# EAGLE schematic connector_motor (EAGLE 7.1.0)
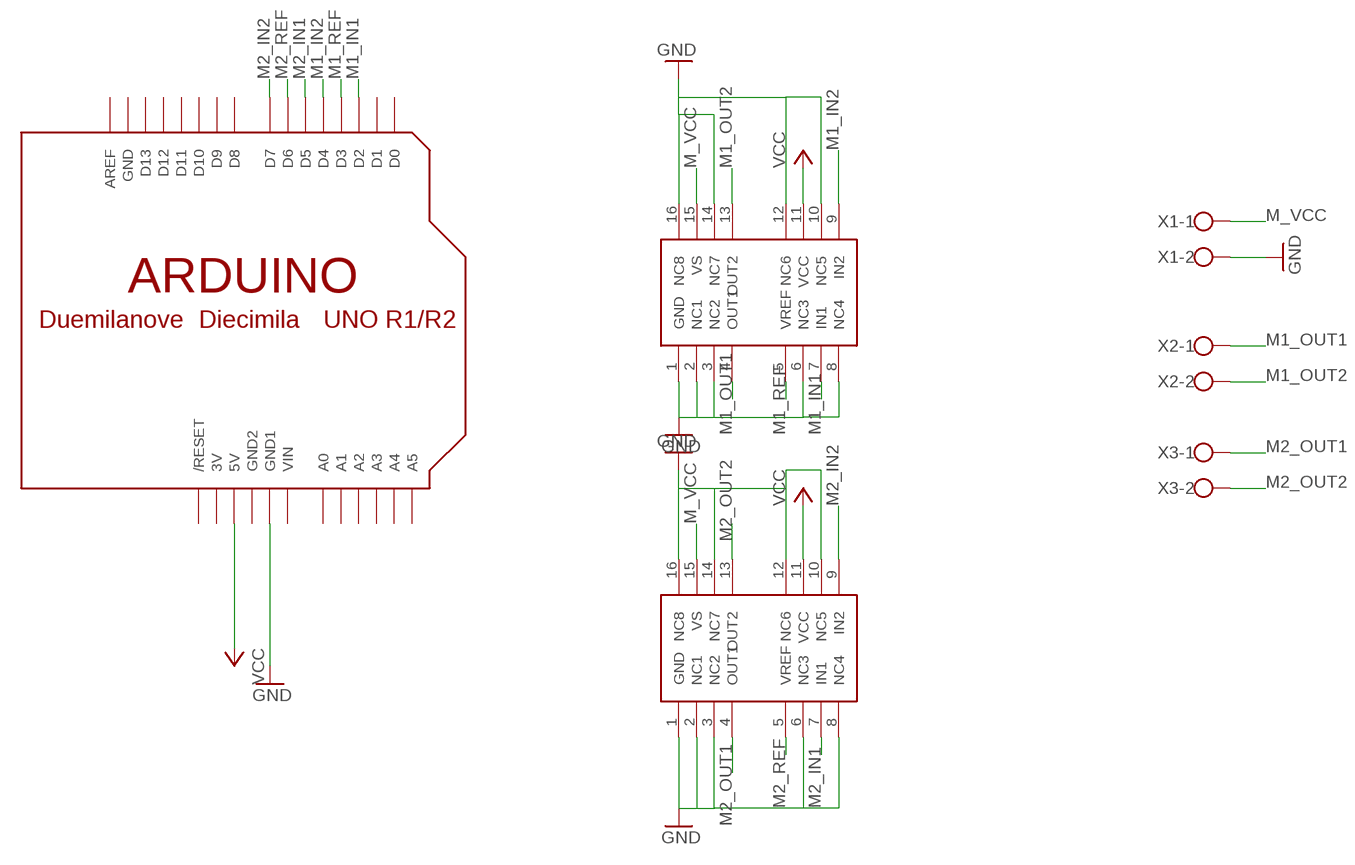
[diagram p0: schematic, sheet 1]

## Parts
U$1  ARDUINO-NOHOLE  [ARDUINO-NOHOLE]
U$3  MOTOR-DRIVER-TA7281FG  [MOTOR-DRIVER-TA7291FG]
U$4  MOTOR-DRIVER-TA7281FG  [MOTOR-DRIVER-TA7291FG]
X1  W237-102  [W237-102]
X2  W237-102  [W237-102]
X3  W237-102  [W237-102]

## Nets
GND: U$1.GND1 U$3.1(GND) U$3.2(NC1) U$3.3(NC2) U$3.6(NC3) U$3.8(NC4) U$3.10(NC5) U$3.12(NC6) U$3.14(NC7) U$3.16(NC8) U$4.1(GND) U$4.2(NC1) U$4.3(NC2) U$4.6(NC3) U$4.8(NC4) U$4.10(NC5) U$4.12(NC6) U$4.14(NC7) U$4.16(NC8) X1.2
M1_IN1: U$1.D2 U$3.7(IN1)
M1_IN2: U$1.D4 U$3.9(IN2)
M1_OUT1: U$3.4(OUT1) X2.1
M1_OUT2: U$3.13(OUT2) X2.2
M1_REF: U$1.D3 U$3.5(VREF)
M2_IN1: U$1.D5 U$4.7(IN1)
M2_IN2: U$1.D7 U$4.9(IN2)
M2_OUT1: U$4.4(OUT1) X3.1
M2_OUT2: U$4.13(OUT2) X3.2
M2_REF: U$1.D6 U$4.5(VREF)
M_VCC: U$3.15(VS) U$4.15(VS) X1.1
VCC: U$1.5V U$3.11(VCC) U$4.11(VCC)
Unconnected: U$1.A0 U$1.A1 U$1.A2 U$1.A3 U$1.A4 U$1.A5 U$1.AREF U$1.D0 U$1.D1 U$1.D8 U$1.D9 U$1.D10 U$1.D11 U$1.D12 U$1.D13 U$1.RESET(/RESET)

## Power pins joined to a net without a drawn wire
3V: U$1.3V
GND: U$1.GND
GND2: U$1.GND2
VIN: U$1.VIN

## Library data of the parts
U$1 = adafruit:ARDUINO: Arduino Diecimila/Duemilanove Make a shield with ease, this package has all the named pins as well as the two mounting drill holes and an outline of the USB and DC power connector. The outline is on the DIMENSION layer, so if your board house uses it they will cut the outline to match. http://www.ladyada.net/library/pcb/eaglelibrary.html
U$3 U$4 = gclue:MOTOR-DRIVER-TA7281FG
X1-X3 = con-wago-500:W237-102: WAGO SCREW CLAMP; MPN: 237-102; OC_FARNELL: unknown; OC_NEWARK: 70K9898